# Altium schematic sheet System Regulators.SchDoc: System Bias Regulators
size A4; ApprovedBy: LD Stanton; CheckedBy: None; Author: LD Stanton; CompanyName: University of Cape Town; DrawnBy: Lawrence Stanton; Engineer: Lawrence Stanton; Organization: University of Cape Town; Address1: Department of Electrical Engineering; Address2: Rondebosch; Address3: Cape Town; Address4: South Africa 7701; DocumentNumber: 1; SheetNumber: 1; SheetTotal: 1; Approv_Date_Eng: --/--/----; Approv_Date_Chk: --/--/----; PCB_Doc: TBD; ASM_Doc: TBD; FAB_Doc: TBD; CML_Doc: TBD; BOM_Doc: TBD
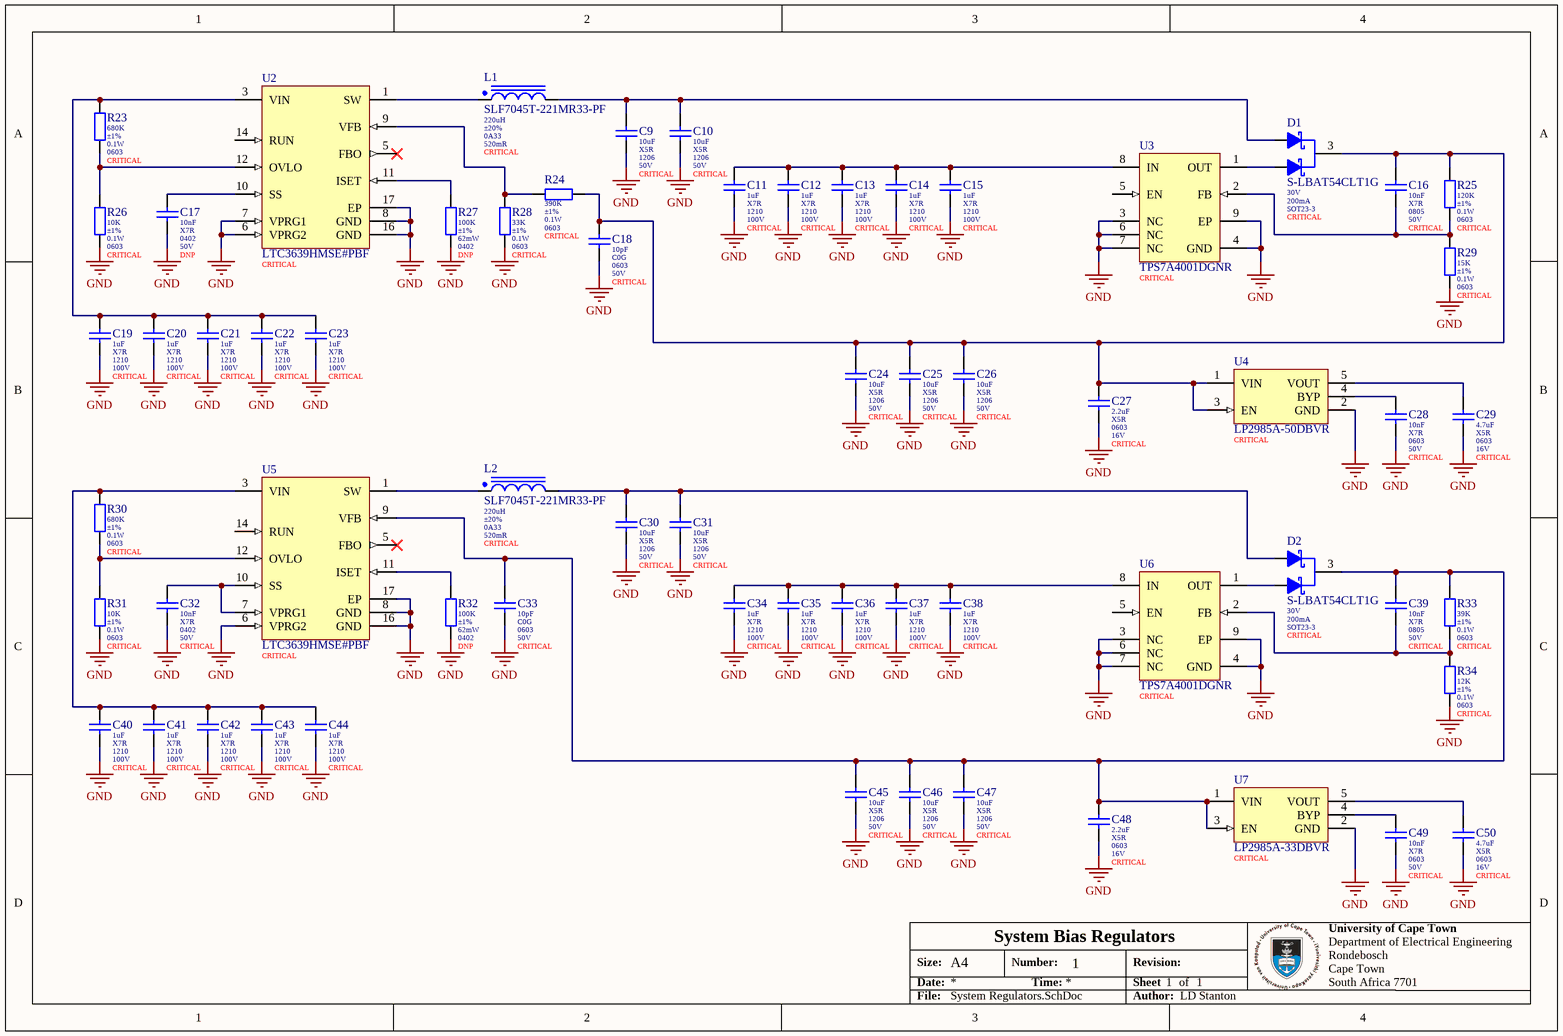
[diagram p0: System Regulators.SchDoc]

## Parts
C9  value 10uF  Dielectric: X5R  Package: 1206  Voltage: 50V  Populate: CRITICAL  [1206_160_H_N]  (hidden comment: CL31A106KBHNNNE)
C10  value 10uF  Dielectric: X5R  Package: 1206  Voltage: 50V  Populate: CRITICAL  [1206_160_H_N]  (hidden comment: CL31A106KBHNNNE)
C11  value 1uF  Dielectric: X7R  Package: 1210  Voltage: 100V  Populate: CRITICAL  [1210_250_J_N]  (hidden comment: CL32B105KCJNNNE)
C12  value 1uF  Dielectric: X7R  Package: 1210  Voltage: 100V  Populate: CRITICAL  [1210_250_J_N]  (hidden comment: CL32B105KCJNNNE)
C13  value 1uF  Dielectric: X7R  Package: 1210  Voltage: 100V  Populate: CRITICAL  [1210_250_J_N]  (hidden comment: CL32B105KCJNNNE)
C14  value 1uF  Dielectric: X7R  Package: 1210  Voltage: 100V  Populate: CRITICAL  [1210_250_J_N]  (hidden comment: CL32B105KCJNNNE)
C15  value 1uF  Dielectric: X7R  Package: 1210  Voltage: 100V  Populate: CRITICAL  [1210_250_J_N]  (hidden comment: CL32B105KCJNNNE)
C16  value 10nF  Dielectric: X7R  Package: 0805  Voltage: 50V  Populate: CRITICAL  [0605_065_A_N]  (hidden comment: CL21B103KBANNNC)
C17  value 10nF  Dielectric: X7R  Package: 0402  Voltage: 50V  Populate: DNP  [0402_050_5_N]  (hidden comment: CL05B103KB5NNNC)
C18  value 10pF  Dielectric: C0G  Package: 0603  Voltage: 50V  Populate: CRITICAL  [0603_080_8_N]  (hidden comment: CL10C100JB8NNNC)
C19  value 1uF  Dielectric: X7R  Package: 1210  Voltage: 100V  Populate: CRITICAL  [1210_250_J_N]  (hidden comment: CL32B105KCJNNNE)
C20  value 1uF  Dielectric: X7R  Package: 1210  Voltage: 100V  Populate: CRITICAL  [1210_250_J_N]  (hidden comment: CL32B105KCJNNNE)
C21  value 1uF  Dielectric: X7R  Package: 1210  Voltage: 100V  Populate: CRITICAL  [1210_250_J_N]  (hidden comment: CL32B105KCJNNNE)
C22  value 1uF  Dielectric: X7R  Package: 1210  Voltage: 100V  Populate: CRITICAL  [1210_250_J_N]  (hidden comment: CL32B105KCJNNNE)
C23  value 1uF  Dielectric: X7R  Package: 1210  Voltage: 100V  Populate: CRITICAL  [1210_250_J_N]  (hidden comment: CL32B105KCJNNNE)
C24  value 10uF  Dielectric: X5R  Package: 1206  Voltage: 50V  Populate: CRITICAL  [1206_160_H_N]  (hidden comment: CL31A106KBHNNNE)
C25  value 10uF  Dielectric: X5R  Package: 1206  Voltage: 50V  Populate: CRITICAL  [1206_160_H_N]  (hidden comment: CL31A106KBHNNNE)
C26  value 10uF  Dielectric: X5R  Package: 1206  Voltage: 50V  Populate: CRITICAL  [1206_160_H_N]  (hidden comment: CL31A106KBHNNNE)
C27  value 2.2uF  Dielectric: X5R  Package: 0603  Voltage: 16V  Populate: CRITICAL  [0603_080_8_N]  (hidden comment: CL10A225KO8NNNC)
C28  value 10nF  Dielectric: X7R  Package: 0603  Voltage: 50V  Populate: CRITICAL  [0603_080]  (hidden comment: 0603B103K500NT)
C29  value 4.7uF  Dielectric: X5R  Package: 0603  Voltage: 16V  Populate: CRITICAL  [0603_080_8_N]  (hidden comment: CL10A475KO8NNNC)
C30  value 10uF  Dielectric: X5R  Package: 1206  Voltage: 50V  Populate: CRITICAL  [1206_160_H_N]  (hidden comment: CL31A106KBHNNNE)
C31  value 10uF  Dielectric: X5R  Package: 1206  Voltage: 50V  Populate: CRITICAL  [1206_160_H_N]  (hidden comment: CL31A106KBHNNNE)
C32  value 10nF  Dielectric: X7R  Package: 0402  Voltage: 50V  Populate: CRITICAL  [0402_050_5_N]  (hidden comment: CL05B103KB5NNNC)
C33  value 10pF  Dielectric: C0G  Package: 0603  Voltage: 50V  Populate: CRITICAL  [0603_080_8_N]  (hidden comment: CL10C100JB8NNNC)
C34  value 1uF  Dielectric: X7R  Package: 1210  Voltage: 100V  Populate: CRITICAL  [1210_250_J_N]  (hidden comment: CL32B105KCJNNNE)
C35  value 1uF  Dielectric: X7R  Package: 1210  Voltage: 100V  Populate: CRITICAL  [1210_250_J_N]  (hidden comment: CL32B105KCJNNNE)
C36  value 1uF  Dielectric: X7R  Package: 1210  Voltage: 100V  Populate: CRITICAL  [1210_250_J_N]  (hidden comment: CL32B105KCJNNNE)
C37  value 1uF  Dielectric: X7R  Package: 1210  Voltage: 100V  Populate: CRITICAL  [1210_250_J_N]  (hidden comment: CL32B105KCJNNNE)
C38  value 1uF  Dielectric: X7R  Package: 1210  Voltage: 100V  Populate: CRITICAL  [1210_250_J_N]  (hidden comment: CL32B105KCJNNNE)
C39  value 10nF  Dielectric: X7R  Package: 0805  Voltage: 50V  Populate: CRITICAL  [0605_065_A_N]  (hidden comment: CL21B103KBANNNC)
C40  value 1uF  Dielectric: X7R  Package: 1210  Voltage: 100V  Populate: CRITICAL  [1210_250_J_N]  (hidden comment: CL32B105KCJNNNE)
C41  value 1uF  Dielectric: X7R  Package: 1210  Voltage: 100V  Populate: CRITICAL  [1210_250_J_N]  (hidden comment: CL32B105KCJNNNE)
C42  value 1uF  Dielectric: X7R  Package: 1210  Voltage: 100V  Populate: CRITICAL  [1210_250_J_N]  (hidden comment: CL32B105KCJNNNE)
C43  value 1uF  Dielectric: X7R  Package: 1210  Voltage: 100V  Populate: CRITICAL  [1210_250_J_N]  (hidden comment: CL32B105KCJNNNE)
C44  value 1uF  Dielectric: X7R  Package: 1210  Voltage: 100V  Populate: CRITICAL  [1210_250_J_N]  (hidden comment: CL32B105KCJNNNE)
C45  value 10uF  Dielectric: X5R  Package: 1206  Voltage: 50V  Populate: CRITICAL  [1206_160_H_N]  (hidden comment: CL31A106KBHNNNE)
C46  value 10uF  Dielectric: X5R  Package: 1206  Voltage: 50V  Populate: CRITICAL  [1206_160_H_N]  (hidden comment: CL31A106KBHNNNE)
C47  value 10uF  Dielectric: X5R  Package: 1206  Voltage: 50V  Populate: CRITICAL  [1206_160_H_N]  (hidden comment: CL31A106KBHNNNE)
C48  value 2.2uF  Dielectric: X5R  Package: 0603  Voltage: 16V  Populate: CRITICAL  [0603_080_8_N]  (hidden comment: CL10A225KO8NNNC)
C49  value 10nF  Dielectric: X7R  Package: 0603  Voltage: 50V  Populate: CRITICAL  [0603_080]  (hidden comment: 0603B103K500NT)
C50  value 4.7uF  Dielectric: X5R  Package: 0603  Voltage: 16V  Populate: CRITICAL  [0603_080_8_N]  (hidden comment: CL10A475KO8NNNC)
D1  S-LBAT54CLT1G  Reverse Voltage: 30V  Forward Current: 200mA  Package: SOT23-3  Placement: CRITICAL  [SOT-23-3 (LBAT54C) B]
D2  S-LBAT54CLT1G  Reverse Voltage: 30V  Forward Current: 200mA  Package: SOT23-3  Placement: CRITICAL  [SOT-23-3 (LBAT54C) B]
L1  SLF7045T-221MR33-PF  value 220uH  Tolerance: ±20%  Rated Current: 0A33  DC Resistance: 520mR  Populate: CRITICAL  [SLF7045 B]
L2  SLF7045T-221MR33-PF  value 220uH  Tolerance: ±20%  Rated Current: 0A33  DC Resistance: 520mR  Populate: CRITICAL  [SLF7045 B]
R23  value 680K  Tolerance: ±1%  Power: 0.1W  Populate: CRITICAL  [0603]  (hidden comment: 0603WAF6803T5E)
R24  value 390K  Tolerance: ±1%  Power: 0.1W  Populate: CRITICAL  [0603]  (hidden comment: 0603WAF3903T5E)
R25  value 120K  Tolerance: ±1%  Power: 0.1W  Populate: CRITICAL  [0603]  (hidden comment: 0603WAF1203T5E)
R26  value 10K  Tolerance: ±1%  Power: 0.1W  Populate: CRITICAL  [0603]  (hidden comment: 0603WAF1002T5E)
R27  value 100K  Tolerance: ±1%  Power: 62mW  Populate: DNP  [0402]  (hidden comment: 0402WGF1003TCE)
R28  value 33K  Tolerance: ±1%  Power: 0.1W  Populate: CRITICAL  [0603]  (hidden comment: 0603WAF3302T5E)
R29  value 15K  Tolerance: ±1%  Power: 0.1W  Populate: CRITICAL  [0603]  (hidden comment: 0603WAF1502T5E)
R30  value 680K  Tolerance: ±1%  Power: 0.1W  Populate: CRITICAL  [0603]  (hidden comment: 0603WAF6803T5E)
R31  value 10K  Tolerance: ±1%  Power: 0.1W  Populate: CRITICAL  [0603]  (hidden comment: 0603WAF1002T5E)
R32  value 100K  Tolerance: ±1%  Power: 62mW  Populate: DNP  [0402]  (hidden comment: 0402WGF1003TCE)
R33  value 39K  Tolerance: ±1%  Power: 0.1W  Populate: CRITICAL  [0603]  (hidden comment: 0603WAF3902T5E)
R34  value 12K  Tolerance: ±1%  Power: 0.1W  Populate: CRITICAL  [0603]  (hidden comment: 0603WAF1202T5E)
U2  LTC3639HMSE#PBF  Placement: CRITICAL  [LT-MSE-16-V(12)4PR-EDP_N]
U3  TPS7A4001DGNR  Placement: CRITICAL  [DGN0008B_N]
U4  LP2985A-50DBVR  Placement: CRITICAL  [SOT-23-5 (DBV0005A) B]
U5  LTC3639HMSE#PBF  Placement: CRITICAL  [LT-MSE-16-V(12)4PR-EDP_N]
U6  TPS7A4001DGNR  Placement: CRITICAL  [DGN0008B_N]
U7  LP2985A-33DBVR  Placement: CRITICAL  [SOT-23-5 (DBV0005A) B]

## Nets
GND: C9.2 C10.2 C11.2 C12.2 C13.2 C14.2 C15.2 C17.2 C18.2 C19.2 C20.2 C21.2 C22.2 C23.2 C24.2 C25.2 C26.2 C27.2 C28.2 C29.2 C30.2 C31.2 C32.2 C33.2 C34.2 C35.2 C36.2 C37.2 C38.2 C40.2 C41.2 C42.2 C43.2 C44.2 C45.2 C46.2 C47.2 C48.2 C49.2 C50.2 R26.2 R27.2 R28.2 R29.2 R31.2 R32.2 R34.2 U2.6(VPRG2) U2.7(VPRG1) U2.8(GND) U2.16(GND) U2.17(EP) U3.3(NC) U3.4(GND) U3.6(NC) U3.7(NC) U3.9(EP) U4.2(GND) U5.6(VPRG2) U5.8(GND) U5.16(GND) U5.17(EP) U6.3(NC) U6.4(GND) U6.6(NC) U6.7(NC) U6.9(EP) U7.2(GND)
NetC9_1: C9.1 C10.1 D1.1(A1) L1.2
NetC11_1: C11.1 C12.1 C13.1 C14.1 C15.1 U3.8(IN)
NetC16_1: C16.1 C18.1 C24.1 C25.1 C26.1 C27.1 D1.3(K) R24.1 R25.1 U4.1(VIN) U4.3(EN)
NetC16_2: C16.2 R25.2 R29.1 U3.2(FB)
NetC17_1: C17.1 U2.10(SS)
NetC19_1: C19.1 C20.1 C21.1 C22.1 C23.1 R23.1 U2.3(VIN)
NetC28_1: C28.1 U4.4(BYP)
NetC29_1: C29.1 U4.5(VOUT)
NetC30_1: C30.1 C31.1 D2.1(A1) L2.2
NetC32_1: C32.1 U5.7(VPRG1) U5.10(SS)
NetC33_1: C33.1 C39.1 C45.1 C46.1 C47.1 C48.1 D2.3(K) R33.1 U5.9(VFB) U7.1(VIN) U7.3(EN)
NetC34_1: C34.1 C35.1 C36.1 C37.1 C38.1 U6.8(IN)
NetC39_2: C39.2 R33.2 R34.1 U6.2(FB)
NetC40_1: C40.1 C41.1 C42.1 C43.1 C44.1 R30.1 U5.3(VIN)
NetC49_1: C49.1 U7.4(BYP)
NetC50_1: C50.1 U7.5(VOUT)
NetD1_2: D1.2(A2) U3.1(OUT)
NetD2_2: D2.2(A2) U6.1(OUT)
NetL1_1: L1.1 U2.1(SW)
NetL2_1: L2.1 U5.1(SW)
NetR23_2: R23.2 R26.1 U2.12(OVLO)
NetR24_2: R24.2 R28.1 U2.9(VFB)
NetR27_1: R27.1 U2.11(ISET)
NetR30_2: R30.2 R31.1 U5.12(OVLO)
NetR32_1: R32.1 U5.11(ISET)

Not connected (* = marked no-connect by the designer): U2 5(FBO)* 14(RUN); U3 5(EN); U5 5(FBO)* 14(RUN); U6 5(EN)

## Notes on the sheet
- Size:
- Date:
- A4
- Number:
- Time:
- Revision:
- Sheet
- of
- File:
- Author:

## Library data of the parts
C9 C10 C24-C26 C30 C31 C45-C47 = CMP-045-000010-6: MLCC 10uF 1206 50V X5R ±10%; Manufacturer: Samsung; ComponentLink1Description: Datasheet; ComponentLink1URL: https://datasheet.lcsc.com/szlcsc/Samsung-Electro-Mechanics-CL05C100JB5NNNC_C32949.pdf; LCSC Part Number: C13585; Tolerance: ±10%
C11-C15 C19-C23 C34-C38 C40-C44 = CMP-014-000009-1: MLCC 1uF 1210 100V X7R ±10%; Manufacturer: Samsung; ComponentLink1URL: https://datasheet.lcsc.com/szlcsc/Samsung-Electro-Mechanics-CL05C100JB5NNNC_C32949.pdf; LCSC Part Number: C444847; ComponentLink1Description: Datasheet; Tolerance: ±10%
C16 C39 = CMP-045-000006-7: MLCC 10nF 0805 50V X7R ±10%; Manufacturer: Samsung; LCSC Part Number: C1710; Tolerance: ±10%; ComponentLink1URL: https://datasheet.lcsc.com/szlcsc/Samsung-Electro-Mechanics-CL05C100JB5NNNC_C32949.pdf; ComponentLink1Description: Datasheet
C17 C32 = CMP-045-000005-8: MLCC 10nF 0402 50V X7R ±10%; Manufacturer: Samsung; ComponentLink1Description: Datasheet; ComponentLink1URL: https://datasheet.lcsc.com/szlcsc/Samsung-Electro-Mechanics-CL05C100JB5NNNC_C32949.pdf; Tolerance: ±10%; LCSC Part Number: C15195
C18 C33 = CMP-045-000007-6: MLCC 10pF 0603 C0G ±0.1pF; Manufacturer: Samsung; LCSC Part Number: C1634; ComponentLink1URL: https://datasheet.lcsc.com/szlcsc/Samsung-Electro-Mechanics-CL05C100JB5NNNC_C32949.pdf; Tolerance: ±0.1pF; ComponentLink1Description: Datasheet
C27 C48 = CMP-045-000016-6: MLCC 2.2uF 0603 16V X5R ±10%; Manufacturer: Samsung; Tolerance: ±10%; LCSC Part Number: C23630; ComponentLink1URL: https://datasheet.lcsc.com/szlcsc/Samsung-Electro-Mechanics-CL05C100JB5NNNC_C32949.pdf; ComponentLink1Description: Datasheet
C28 C49 = CMP-014-000000-7: MLCC 10nF 0603 50V X7R ±10%; Manufacturer: Guandong; Tolerance: ±15%; LCSC Part Number: C57112; ComponentLink1URL: https://datasheet.lcsc.com/szlcsc/Guangdong-Fenghua-Advanced-Tech-0402B102K500NT_C1523.pdf; ComponentLink1Description: Datasheet
C29 C50 = CMP-014-000007-3: MLCC 4.7uF 0603 16V X5R ±10%; Manufacturer: Samsung; LCSC Part Number: C19666; Tolerance: ±10%; ComponentLink1Description: Datasheet; ComponentLink1URL: https://datasheet.lcsc.com/szlcsc/Samsung-Electro-Mechanics-CL05C100JB5NNNC_C32949.pdf
D1 D2 = CMP-022-000007-2: Schottky Barrier Diode Common Cathode 30V 200mA; Manufacturer: LRC; ComponentLink1URL: https://datasheet.lcsc.com/lcsc/2006151233_LRC-S-LBAT54CLT1G_C559091.pdf; Source: Schottky Barrier Diodes.SchLib; ComponentLink1Description: Datasheet; LCSC Part Number: C559091; Design Item ID: LBAT54CLT1G
L1 L2 = CMP-032-000004-1: Inductor 220uH ±20% 0A65 470mR Wirewound Shielded; Manufacturer: TDK; Core: Ferrite; Saturation Current: 0A33; ComponentLink1URL: https://product.tdk.com/system/files/dam/doc/product/inductor/inductor/smd/catalog/inductor_commercial_power_slf7045_en.pdf; RoHS: Yes; ComponentLink1Description: Datasheet; Shielding: Shielded; LCSC Part Number: C24679; Min Operating Temperature: -40°C; Max Operating Temperature: 85°C
R23 R30 = CMP-010-000364-1: Resistor 680K 0603 ±1% Thick Film Uniroyal; Temperature Coefficient: ±100ppm/K; Working Voltage: 50V; Package: 0603; LCSC Part Number: C25822; Manufacturer: Uniroyal; ComponentLink1URL: https://datasheet.lcsc.com/szlcsc/1811062009_UNI-ROYAL-Uniroyal-Elec-0603WAF1002T5E_C25804.pdf; Temperature: -55 - 155°C; ComponentLink1Description: Datasheet; Pin Count: 2
R24 = CMP-010-000333-5: Resistor 390K 0603 ±1%Thick Film Uniroyal Elec; Package: 0603; Pin Count: 2; ComponentLink1Description: Datasheet; LCSC Part Number: C23150; Design Item ID: Res 390K 0603; Temperature: -55 - 155°C; Component Type: Standard; Source: Resistors.SchLib; ComponentLink1URL: https://datasheet.lcsc.com/szlcsc/1811062009_UNI-ROYAL-Uniroyal-Elec-0603WAF1002T5E_C25804.pdf
R25 = CMP-010-000365-1: Resistor 120K 0603 ±1% Thick Film Uniroyal; Temperature Coefficient: ±100ppm/K; Working Voltage: 50V; Package: 0603; Manufacturer: Uniroyal; Pin Count: 2; ComponentLink1URL: https://datasheet.lcsc.com/szlcsc/1811062009_UNI-ROYAL-Uniroyal-Elec-0603WAF1002T5E_C25804.pdf; LCSC Part Number: C25808; Temperature: -55 - 155°C; ComponentLink1Description: Datasheet
R26 R31 = CMP-010-000293-7: Resistor 10K 0603 ±1% Thick Film Uniroyal; Working Voltage: 50V; Temperature Coefficient: ±100ppm/K; Package: 0603; Pin Count: 2; Temperature: -55 - 155°C; Manufacturer: Uniroyal; ComponentLink1URL: https://datasheet.lcsc.com/szlcsc/1811062009_UNI-ROYAL-Uniroyal-Elec-0603WAF1002T5E_C25804.pdf; ComponentLink1Description: Datasheet; LCSC Part Number: C25804
R27 R32 = CMP-010-000287-8: Resistor 100K 0402 ±1% Thick Film Uniroyal; Temperature Coefficient: ±100ppm/K; Working Voltage: 50V; Package: 0402; Pin Count: 2; ComponentLink1Description: Datasheet; Temperature: -55 - 155°C; LCSC Part Number: C25741; Manufacturer: Uniroyal; ComponentLink1URL: https://datasheet.lcsc.com/szlcsc/1811062009_UNI-ROYAL-Uniroyal-Elec-0603WAF1002T5E_C25804.pdf
R28 = CMP-010-000332-8: Resistor 33K 0603 ±1% Thick Film Uniroyal; Working Voltage: 50V; Temperature Coefficient: ±100ppm/K; Package: 0603; LCSC Part Number: C4216; ComponentLink1Description: Datasheet; Pin Count: 2; Manufacturer: Uniroyal; ComponentLink1URL: https://datasheet.lcsc.com/szlcsc/1811062009_UNI-ROYAL-Uniroyal-Elec-0603WAF1002T5E_C25804.pdf; Temperature: -55 - 155°C
R29 = CMP-010-000363-2: Resistor 15K 0603 ±1% Thick Film Uniroyal; Temperature Coefficient: ±100ppm/K; Working Voltage: 50V; Package: 0603; ComponentLink1URL: https://datasheet.lcsc.com/szlcsc/1811062009_UNI-ROYAL-Uniroyal-Elec-0603WAF1002T5E_C25804.pdf; Manufacturer: Uniroyal; Temperature: -55 - 155°C; Pin Count: 2; ComponentLink1Description: Datasheet; LCSC Part Number: C22809
R33 = CMP-010-000366-1: Resistor 39K 0603 ±1% Thick Film Uniroyal; Temperature Coefficient: ±100ppm/K; Working Voltage: 50V; Package: 0603; ComponentLink1URL: https://datasheet.lcsc.com/szlcsc/1811062009_UNI-ROYAL-Uniroyal-Elec-0603WAF1002T5E_C25804.pdf; ComponentLink1Description: Datasheet; Pin Count: 2; Manufacturer: Uniroyal; Temperature: -55 - 155°C
R34 = CMP-010-000351-9: Resistor 12K 0603 ±1% Thick Film Uniroyal; Working Voltage: 50V; Temperature Coefficient: ±100ppm/K; Package: 0603; Manufacturer: Uniroyal; ComponentLink1URL: https://datasheet.lcsc.com/szlcsc/1811062009_UNI-ROYAL-Uniroyal-Elec-0603WAF1002T5E_C25804.pdf; Pin Count: 2; LCSC Part Number: C22790; ComponentLink1Description: Datasheet; Temperature: -55 - 155°C
U2 U5 = CMP-055-000003-2: DC-DC Conv 4V to 150V Synchronous Step Down Single-Out 0.8V to 150V 0.1A Automotive 12-Pin MSOP EP; Min Output Voltage: 800mV; Output Current: 100mA; LCSC Part Number: C117279; Min Input Voltage: 4V; ComponentLink1Description: Datasheet; RoHS: Yes; Package: SOP; Temperature: -40°C - 125°C; Max Output Voltage: 150V; ComponentLink1URL: https://www.analog.com/media/en/technical-documentation/data-sheets/3639fd.pdf
U3 U6 = CMP-008-000008-3: Adjustable LDO Voltage Regulator, 7 V to 100 V, 780 mV Drop, 1.161 V to 90 V / 50 mA out, MSOP-8; Reference Voltage: 1.185V; Max Input Voltage: 100V; Output Voltage: 90V; Max Output Current: 50mA; Quiescent Current: 20uA; Min Output Voltage: 1.2V; Max Power Dissipation: 833mW; Power: 1.83W; Min Input Voltage: 7V; Dropout Voltage: 780mV; LCSC Part Number: C55006; ComponentLink1URL: https://www.ti.com/lit/ds/symlink/tps7a4001.pdf?HQS=dis-dk-null-digikeymode-dsf-pf-null-wwe&ts=1626937665102&ref_url=https%253A%252F%252Fwww.digikey.de%252F; Package: MSOP; Max Output Voltage: 90V; RoHS: Yes; ComponentLink1Description: Datasheet; Output Current: 50mA; Temperature: -40°C - 125°C
U4 = CMP-008-000009-4: LDO Fixed 5V, 0.15A, 1% Accuracy, Max 16V Input, 65uA Iq, SOT-23-5; Manufacturer: Texas Instruments; Max Output Current: 150mA; Dropout Voltage: 280mV; Min Input Voltage: 2.2V; Max Supply Voltage: 16V; Max Operating Temperature: 125°C; RoHS: Yes; Accuracy: 1%; Min Operating Temperature: -40°C; LCSC Part Number: C109382; Output Voltage: 5V; ComponentLink1Description: Datasheet; Case/Package: SOT-23-5; Max Output Voltage: 5V; Quiescent Current: 65uA; ComponentLink1URL: https://www.ti.com/lit/ds/symlink/lp2985.pdf?ts=1627290889620&ref_url=https%253A%252F%252Fwww.google.com%252F; Max Input Voltage: 16V
U7 = CMP-008-000010-2: LDO Fixed 3V3, 0.15A, 1% Accuracy, Max 16V Input, 65uA Iq, SOT-23-5; Manufacturer: Texas Instruments; Min Input Voltage: 2.2V; Dropout Voltage: 280mV; Max Output Voltage: 5V; Output Voltage: 3.3V; Max Output Current: 150mA; Max Supply Voltage: 16V; Max Input Voltage: 16V; ComponentLink1Description: Datasheet; Min Operating Temperature: -40°C; Case/Package: SOT-23-5; ComponentLink1URL: https://www.ti.com/lit/ds/symlink/lp2985.pdf?ts=1627290889620&ref_url=https%253A%252F%252Fwww.google.com%252F; Accuracy: 1%; Max Operating Temperature: 125°C; Quiescent Current: 65uA; LCSC Part Number: C89826; RoHS: Yes